# Altium schematic sheet Main.SchDoc
size A; SheetNumber: 1; SheetTotal: 2
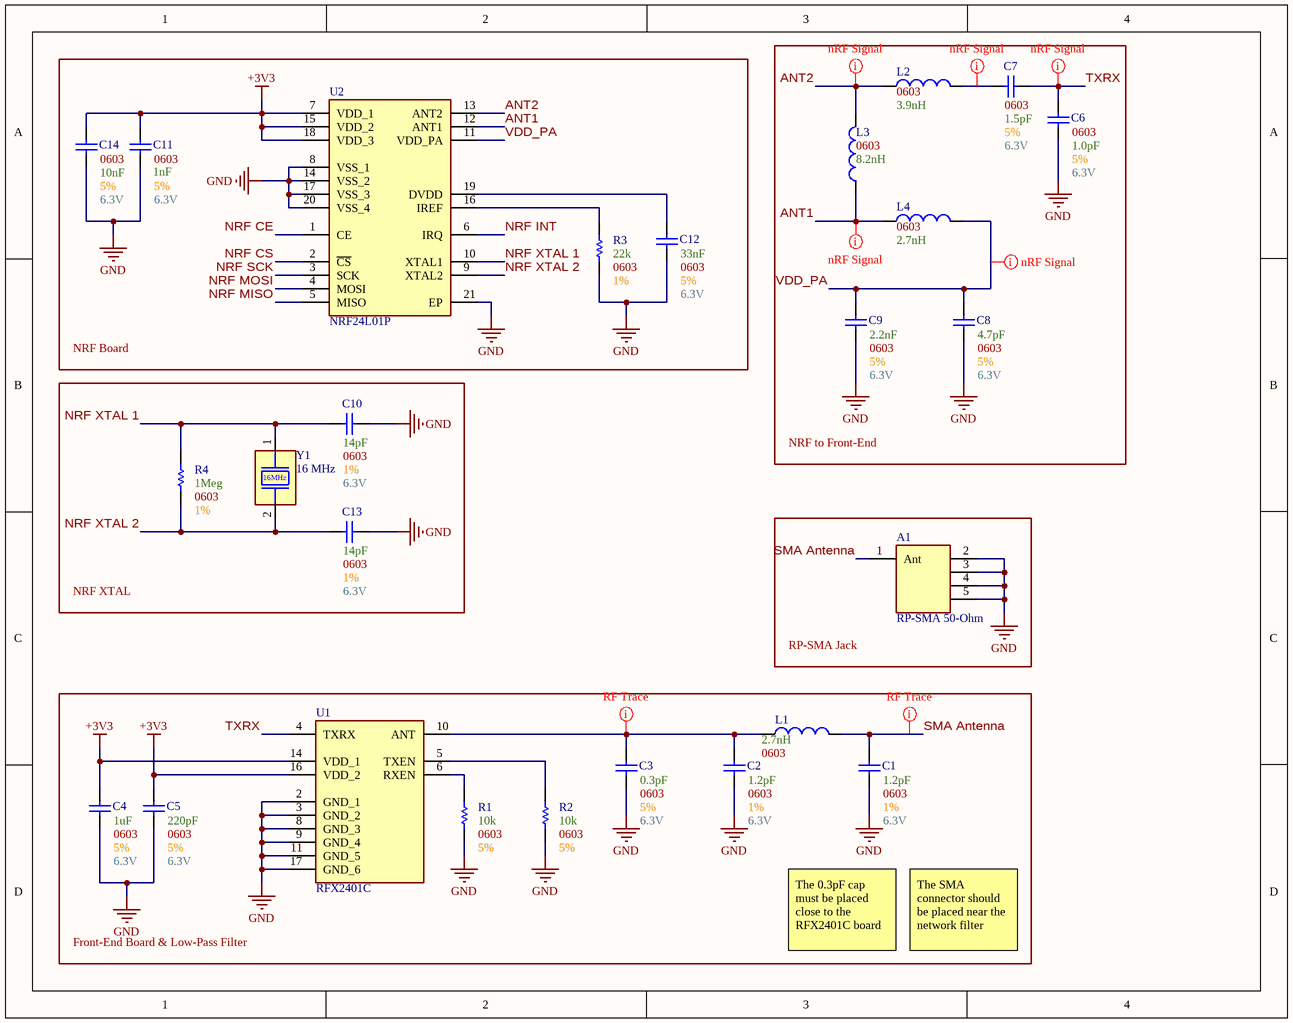
[diagram p0: Main.SchDoc]

## Parts
A1  RP-SMA 50-Ohm  [[SMA] RP-SMA 90deg Jack]
C1  Voltage: 6.3V  Tolerance: 1%  Size Package: 0603  Capacitance: 1.2pF  [[Cap] SMD 0603]  (hidden comment: SMD Nonpolarized)
C2  Voltage: 6.3V  Tolerance: 1%  Size Package: 0603  Capacitance: 1.2pF  [[Cap] SMD 0603]  (hidden comment: SMD Nonpolarized)
C3  Tolerance: 5%  Size Package: 0603  Capacitance: 0.3pF  Voltage: 6.3V  [[Cap] SMD 0603]  (hidden comment: SMD Nonpolarized)
C4  Tolerance: 5%  Size Package: 0603  Capacitance: 1uF  Voltage: 6.3V  [[Cap] SMD 0603]  (hidden comment: SMD Nonpolarized)
C5  Tolerance: 5%  Size Package: 0603  Capacitance: 220pF  Voltage: 6.3V  [[Cap] SMD 0603]  (hidden comment: SMD Nonpolarized)
C6  Tolerance: 5%  Size Package: 0603  Capacitance: 1.0pF  Voltage: 6.3V  [[Cap] SMD 0603]  (hidden comment: SMD Nonpolarized)
C7  Tolerance: 5%  Size Package: 0603  Capacitance: 1.5pF  Voltage: 6.3V  [[Cap] SMD 0603]  (hidden comment: SMD Nonpolarized)
C8  Tolerance: 5%  Size Package: 0603  Capacitance: 4.7pF  Voltage: 6.3V  [[Cap] SMD 0603]  (hidden comment: SMD Nonpolarized)
C9  Tolerance: 5%  Size Package: 0603  Capacitance: 2.2nF  Voltage: 6.3V  [[Cap] SMD 0603]  (hidden comment: SMD Nonpolarized)
C10  Tolerance: 1%  Size Package: 0603  Capacitance: 14pF  Voltage: 6.3V  [[Cap] SMD 0603]  (hidden comment: SMD Nonpolarized)
C11  Tolerance: 5%  Size Package: 0603  Capacitance: 1nF  Voltage: 6.3V  [[Cap] SMD 0603]  (hidden comment: SMD Nonpolarized)
C12  Tolerance: 5%  Size Package: 0603  Capacitance: 33nF  Voltage: 6.3V  [[Cap] SMD 0603]  (hidden comment: SMD Nonpolarized)
C13  Tolerance: 1%  Size Package: 0603  Capacitance: 14pF  Voltage: 6.3V  [[Cap] SMD 0603]  (hidden comment: SMD Nonpolarized)
C14  Tolerance: 5%  Size Package: 0603  Capacitance: 10nF  Voltage: 6.3V  [[Cap] SMD 0603]  (hidden comment: SMD Nonpolarized)
L1  Size Package: 0603  Inductance: 2.7nH  [[Inductor] SMD 0603]  (hidden comment: SMD Inductor)
L2  Size Package: 0603  Inductance: 3.9nH  [[Inductor] SMD 0603]  (hidden comment: SMD Inductor)
L3  Size Package: 0603  Inductance: 8.2nH  [[Inductor] SMD 0603]  (hidden comment: SMD Inductor)
L4  Size Package: 0603  Inductance: 2.7nH  [[Inductor] SMD 0603]  (hidden comment: SMD Inductor)
R1  Tolerance: 5%  Resistance: 10k  Size Package: 0603  [[Res] SMD 0603]  (hidden comment: [Res] SMD Resistor)
R2  Tolerance: 5%  Resistance: 10k  Size Package: 0603  [[Res] SMD 0603]  (hidden comment: [Res] SMD Resistor)
R3  Tolerance: 1%  Resistance: 22k  Size Package: 0603  [[Res] SMD 0603]  (hidden comment: [Res] SMD Resistor)
R4  Tolerance: 1%  Resistance: 1Meg  Size Package: 0603  [[Res] SMD 0603]  (hidden comment: [Res] SMD Resistor)
U1  RFX2401C  [[IC] RF Front-End]
U2  NRF24L01P  [[IC] NRF Transceiver]
Y1  16 MHz  [[XTAL] SMD 16MHz (2)]

## Blocks framed on the sheet
NRF Board: C11 C12 C14 R3 U2
NRF to Front-End: C6-C9 L2-L4
NRF XTAL: C10 C13 R4 Y1
RP-SMA Jack: A1
Front-End Board & Low-Pass Filter: C1-C5 L1 R1 R2 U1

## Nets
+3V3: C4.2 C5.2 C11.2 C14.2 U1.14(VDD_1) U1.16(VDD_2) U2.7(VDD_1) U2.15(VDD_2) U2.18(VDD_3)
GND: A1.2 A1.3 A1.4 A1.5 C1.1 C2.1 C3.1 C4.1 C5.1 C6.2 C8.1 C9.1 C10.2 C11.1 C12.1 C13.2 C14.1 R1.1 R2.1 R3.1 U1.2(GND_1) U1.3(GND_2) U1.8(GND_3) U1.9(GND_4) U1.11(GND_5) U1.17(GND_6) U2.8(VSS_1) U2.14(VSS_2) U2.17(VSS_3) U2.20(VSS_4) U2.21(EP)
ANT1: L3.1 L4.1 U2.12(ANT1)
ANT2: L2.1 L3.2 U2.13(ANT2)
NRF CE: U2.1(CE)
NRF CS: U2.2(~{CS})
NRF INT: U2.6(IRQ)
NRF MISO: U2.5(MISO)
NRF MOSI: U2.4(MOSI)
NRF SCK: U2.3(SCK)
NRF XTAL 1: C10.1 R4.1 U2.10(XTAL1) Y1.1(XTAL1)
NRF XTAL 2: C13.1 R4.2 U2.9(XTAL2) Y1.2(XTAL2)
SMA Antenna: A1.1(Ant) C1.2 L1.2
TXRX: C6.1 C7.1 U1.4(TXRX)
VDD_PA: C8.2 C9.2 L4.2 U2.11(VDD_PA)
NetC2_2: C2.2 C3.2 L1.1 U1.10(ANT)
NetC7_2: C7.2 L2.2
NetC12_2: C12.2 U2.19(DVDD)
NetR1_2: R1.2 U1.6(RXEN)
NetR2_2: R2.2 U1.5(TXEN)
NetR3_2: R3.2 U2.16(IREF)

## Layout directives
net class nRF Signal: ANT1, ANT2, NetC2_2, NetC7_2, SMA Antenna, TXRX, VDD_PA

## Notes on the sheet
- The 0.3pF cap must be placed close to the RFX2401C board
- The SMA connector should be placed near the network filter
- (in symbol [XTAL] SMD 16MHz (2)) 16MHz

## Library data of the parts
A1 = [SMA] RP-SMA 90deg Jack: PCB.RPSMAFRA.HT; Supplier 1: DigiKey; Supplier Part Number 1: 931-1360-ND
C1-C14 = [Cap] SMD Nonpolarized: Supplier 1: DigiKey
  C1 C2: Supplier Part Number 1: 4713-CHV0603N2501R2BCT-ND
  C3: Supplier Part Number 1: 712-QSCP251Q0R3A1GV001TCT-ND
  C4: Supplier Part Number 1: 311-3485-1-ND
  C5: Supplier Part Number 1: 399-C0603C221J5GAC7411CT-ND
  C6: Supplier Part Number 1: 311-1049-1-ND
  C7: Supplier Part Number 1: 311-1737-1-ND
  C8: Supplier Part Number 1: 13-CC0603CPNPO9BN4R7CT-ND
  C9: Supplier Part Number 1: 490-1459-1-ND
  C10 C13: Supplier Part Number 1: 311-3887-1-ND
  C11: Supplier Part Number 1: 490-1451-6-ND
  C12: Supplier Part Number 1: 311-4015-1-ND
  C14: Supplier Part Number 1: 399-C0603C103J5RACTUDKR-ND
L1-L4 = [Inductor] SMD Inductor: JLC Part #: *; Mouser Part #: *; Supplier 1: DigiKey
  L1: Supplier Part Number 1: 732-7447860027GCT-ND
  L2: Supplier Part Number 1: 490-1105-1-ND
  L3: Supplier Part Number 1: 490-1109-1-ND
  L4: Supplier Part Number 1: 490-1103-1-ND
R1-R4 = [Res] SMD Resistor: Generic; Supplier 1: DigiKey
  R1 R2: Supplier Part Number 1: 311-10.0KHRDKR-ND
  R3: Supplier Part Number 1: 311-22.0HRDKR-ND
  R4: Supplier Part Number 1: YAG4498CT-ND
U1 = [IC] RF Front-End: Supplier 1: DigiKey; Supplier Part Number 1: 863-1828-1-ND
U2 = [IC] NRF Transceiver: NRF24L01P-R; Supplier 1: DigiKey; Supplier Part Number 1: 4823-NRF24L01P-RCT-ND
Y1 = [XTAL] SMD 16MHz (2): ABM11-16.000MHZ-12-N1G-T; Supplier 1: DigiKey; Supplier Part Number 1: 535-14950-1-ND